# EAGLE design edu (EAGLE 7.7.0)

## Sheet 1 of 2
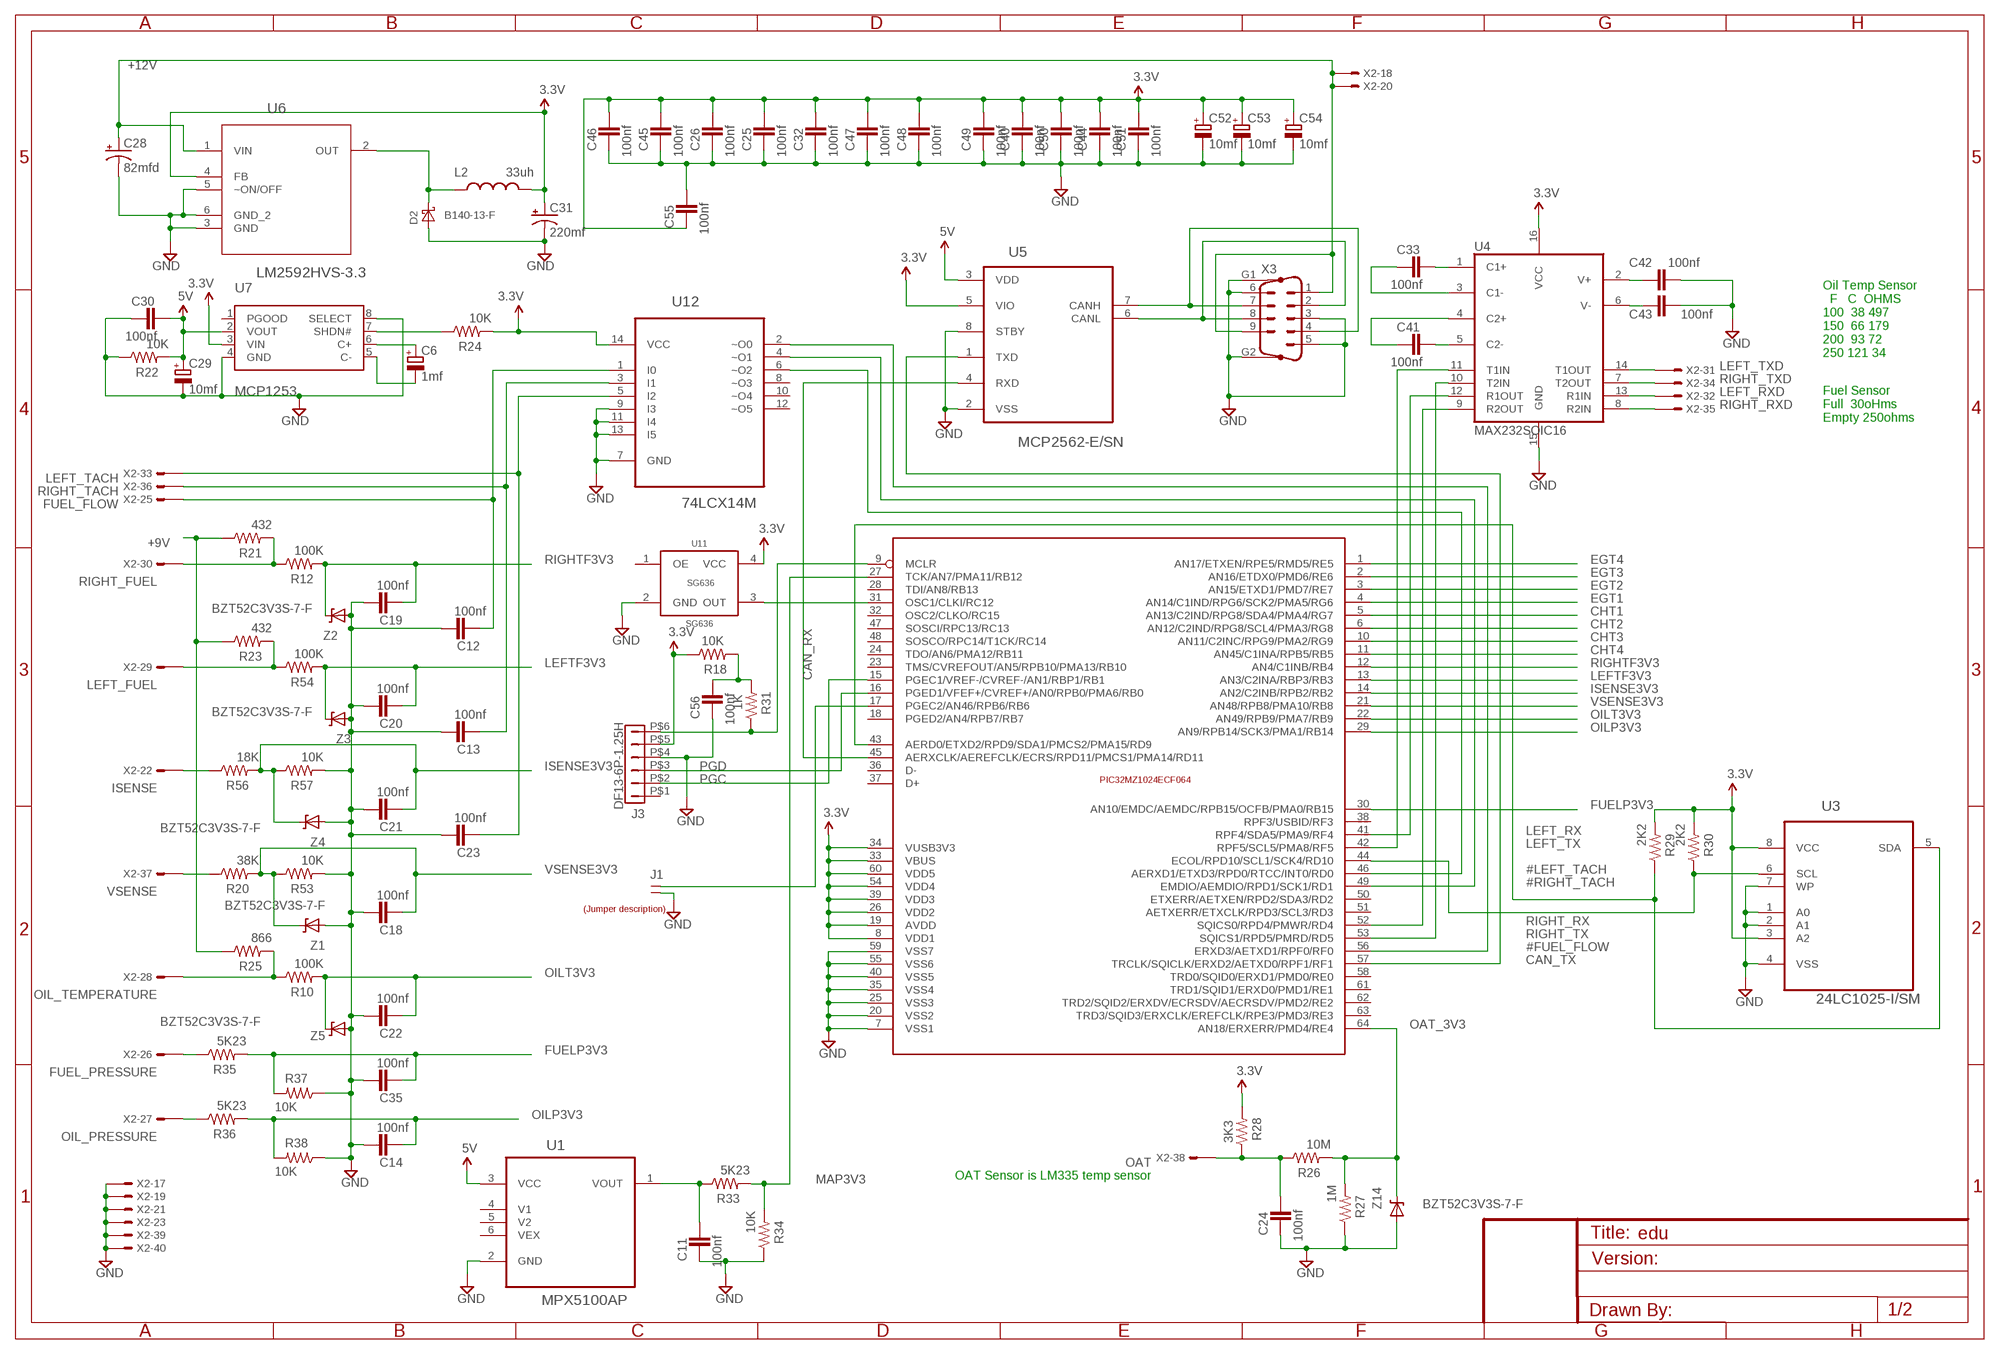
[diagram p0: schematic, sheet 1]

### Parts
C6  1mf  CAPACITOR_POL-SMC_A  [SMC_A]
C11  100nf  CAPACITOR_NPOL-0805  [C805]
C12  100nf  CAPACITOR_NPOL-0805  [C805]
C13  100nf  CAPACITOR_NPOL-0805  [C805]
C14  100nf  CAPACITOR_NPOL-0805  [C805]
C18  100nf  CAPACITOR_NPOL-0805  [C805]
C19  100nf  CAPACITOR_NPOL-0805  [C805]
C20  100nf  CAPACITOR_NPOL-0805  [C805]
C21  100nf  CAPACITOR_NPOL-0805  [C805]
C22  100nf  CAPACITOR_NPOL-0805  [C805]
C23  100nf  CAPACITOR_NPOL-0805  [C805]
C24  100nf  CAPACITOR_NPOL-0805  [C805]
C25  100nf  CAPACITOR_NPOL-0805  [C805]
C26  100nf  CAPACITOR_NPOL-0805  [C805]
C28  82mfd  CAPACITOR_POL-SVPF-E7  [SVPF-E7]
C29  10mf  CAPACITOR_POL-SMC_A  [SMC_A]
C30  100nf  CAPACITOR_NPOL-0805  [C805]
C31  220mf  CAP_POL7343  [EIA7343]
C32  100nf  CAPACITOR_NPOL-0805  [C805]
C33  100nf  CAPACITOR_NPOL-0805  [C805]
C35  100nf  CAPACITOR_NPOL-0805  [C805]
C40  100nf  CAPACITOR_NPOL-0805  [C805]
C41  100nf  CAPACITOR_NPOL-0805  [C805]
C42  100nf  CAPACITOR_NPOL-0805  [C805]
C43  100nf  CAPACITOR_NPOL-0805  [C805]
C44  100nf  CAPACITOR_NPOL-0805  [C805]
C45  100nf  CAPACITOR_NPOL-0805  [C805]
C46  100nf  CAPACITOR_NPOL-0805  [C805]
C47  100nf  CAPACITOR_NPOL-0805  [C805]
C48  100nf  CAPACITOR_NPOL-0805  [C805]
C49  100nf  CAPACITOR_NPOL-0805  [C805]
C50  100nf  CAPACITOR_NPOL-0805  [C805]
C51  100nf  CAPACITOR_NPOL-0805  [C805]
C52  10mf  CAPACITOR_POL-SMC_A  [SMC_A]
C53  10mf  CAPACITOR_POL-SMC_A  [SMC_A]
C54  10mf  CAPACITOR_POL-SMC_A  [SMC_A]
C55  100nf  CAPACITOR_NPOL-0805  [C805]
C56  100nf  CAPACITOR_NPOL-0805  [C805]
D2  B140-13-F  DIODE-SCHOTTKY-SMA  [SMA]
J1  M20-9770246  JUMPER-1X2  [JUMPER-1X2]
J3  DF13-6P-1.25H  [DF13A-6P-1.25H]
L2  33uh  INDUCTOR  [1812]
R10  100K  RESISTOR0603-RES  [0603-RES]
R12  100K  RESISTOR0603-RES  [0603-RES]
R18  10K  RESISTOR0603-RES  [0603-RES]
R20  38K  RESISTOR0603-RES  [0603-RES]
R21  432  RESISTOR0603-RES  [0603-RES]
R22  10K  RESISTOR0603-RES  [0603-RES]
R23  432  RESISTOR0603-RES  [0603-RES]
R24  10K  RESISTOR0603-RES  [0603-RES]
R25  866  RESISTOR0603-RES  [0603-RES]
R26  10M  RESISTOR0603-RES  [0603-RES]
R27  1M  RESISTOR0603-RES  [0603-RES]
R28  3K3  RESISTOR0603-RES  [0603-RES]
R29  2K2  RESISTOR0603-RES  [0603-RES]
R30  2K2  RESISTOR0603-RES  [0603-RES]
R31  1K  RESISTOR0603-RES  [0603-RES]
R33  5K23  RESISTOR0603-RES  [0603-RES]
R34  10K  RESISTOR0603-RES  [0603-RES]
R35  5K23  RESISTOR0603-RES  [0603-RES]
R36  5K23  RESISTOR0603-RES  [0603-RES]
R37  10K  RESISTOR0603-RES  [0603-RES]
R38  10K  RESISTOR0603-RES  [0603-RES]
R53  10K  RESISTOR0603-RES  [0603-RES]
R54  100K  RESISTOR0603-RES  [0603-RES]
R56  18K  RESISTOR0603-RES  [0603-RES]
R57  10K  RESISTOR0603-RES  [0603-RES]
U1  MPX5100AP  [FREESCALE_CASE_867B-04]
U3  24LC1025-I/SM  [SOIC8-N_MC]
U4  MAX232SOIC16  [SO016]
U5  MCP2562-E/SN  [SOIC-8N]
U6  LM2592HVS-3.3  LM2592HVS-5.0  [TO170P1435X457-5N]
U7  MCP1253  [MSOP8]
U11  SG636  [SG636]
U12  74LCX14M  [SOIC127P600X175-14N]
U$2  PIC32MZ1024  [TQFP-64]
U$5  LABEL_JUMPER_1X2  [JUMP2_DESC]
X2  057-040-1  [057-040-1]
X3  M09HP  [M09HP]
Z1  BZT52C3V3S-7-F  DIODE-ZENER-BZT52  [SOD-323]
Z2  BZT52C3V3S-7-F  DIODE-ZENER-BZT52  [SOD-323]
Z3  BZT52C3V3S-7-F  DIODE-ZENER-BZT52  [SOD-323]
Z4  BZT52C3V3S-7-F  DIODE-ZENER-BZT52  [SOD-323]
Z5  BZT52C3V3S-7-F  DIODE-ZENER-BZT52  [SOD-323]
Z14  BZT52C3V3S-7-F  DIODE-ZENER-BZT52  [SOD-323]

### Nets
3.3V: C25.1 C26.1 C31.A(+) C32.1 C40.1 C44.1 C45.1 C46.1 C47.1 C48.1 C49.1 C50.1 C51.1 C52.+ C53.+ C54.+ C55.2 J3.P$5 L2.2 R18.1 R24.2 R28.2 R29.2 R30.2 U3.3(A2) U3.8(VCC) U4.16(VCC) U5.5(VIO) U6.4(FB) U7.3(VIN) U11.4(VCC) U12.14(VCC) U$2.8(VDD1) U$2.19(AVDD) U$2.26(VDD2) U$2.33(VBUS) U$2.34(VUSB3V3) U$2.39(VDD3) U$2.54(VDD4) U$2.60(VDD5)
5V: C29.+ C30.1 R22.2 U1.3(VCC) U5.3(VDD) U7.2(VOUT)
!MCLR: J3.P$6 R31.1 U$2.9(MCLR)
#FUEL_FLOW: U12.2(~O0) U$2.56(ERXD3/AETXD1/RPF0/RF0)
#LEFT_TACH: U12.6(~O2) U$2.46(AERXD1/ETXD3/RPD0/RTCC/INT0/RD0)
#RIGHT_TACH: U12.4(~O1) U$2.49(EMDIO/AEMDIO/RPD1/SCK1/RD1)
+9V [8v]: R21.1 R23.1 R25.1 ; also sheet 2
+12V: C28.P$2(+) U6.1(VIN) X2.18 X2.20 X3.1 X3.9 ; also sheet 2
CAN_RX: U5.4(RXD) U$2.45(AERXCLK/AEREFCLK/ECRS/RPD11/PMCS1/PMA14/RD11)
CAN_TX: U5.1(TXD) U$2.57(TRCLK/SQICLK/ERXD2/AETXD0/RPF1/RF1)
CANH: U5.7(CANH) X3.4 X3.7
CANL: U5.6(CANL) X3.2 X3.8
CHT1: U$2.5(AN13/C2IND/RPG8/SDA4/PMA4/RG7) ; also sheet 2
CHT2: U$2.6(AN12/C2IND/RPG8/SCL4/PMA3/RG8) ; also sheet 2
CHT3: U$2.10(AN11/C2INC/RPG9/PMA2/RG9) ; also sheet 2
CHT4: U$2.11(AN45/C1INA/RPB5/RB5) ; also sheet 2
EGT1: U$2.4(AN14/C1IND/RPG6/SCK2/PMA5/RG6) ; also sheet 2
EGT2: U$2.3(AN15/ETXD1/PMD7/RE7) ; also sheet 2
EGT3: U$2.2(AN16/ETDX0/PMD6/RE6) ; also sheet 2
EGT4: U$2.1(AN17/ETXEN/RPE5/RMD5/RE5) ; also sheet 2
FUEL_FLOW: C12.2 U12.1(I0) X2.25
FUEL_PRESSURE: R35.1 X2.26
FUELP3V3: C35.2 R35.2 R37.2 U$2.30(AN10/EMDC/AEMDC/RPB15/OCFB/PMA0/RB15)
GND: C11.2 C12.1 C13.1 C14.1 C18.1 C19.1 C20.1 C21.1 C22.1 C23.1 C24.2 C25.2 C26.2 C28.P$1(-) C29.- C30.2 C31.C(-) C32.2 C35.1 C40.2 C42.1 C43.1 C44.2 C45.2 C46.2 C47.2 C48.2 C49.2 C50.2 C51.2 C52.- C53.- C54.- C55.1 C56.2 D2.A J1.2 J3.P$4 R22.1 R27.1 R34.1 R37.1 R38.1 R53.2 R57.2 U1.2(GND) U3.1(A0) U3.2(A1) U3.4(VSS) U3.7(WP) U4.15(GND) U5.2(VSS) U5.8(STBY) U6.3(GND) U6.5(~ON/OFF) U6.6(GND_2) U7.4(GND) U7.8(SELECT) U11.2(GND) U12.7(GND) U12.9(I3) U12.11(I4) U12.13(I5) U$2.7(VSS1) U$2.20(VSS2) U$2.25(VSS3) U$2.35(VSS4) U$2.40(VSS5) U$2.55(VSS6) U$2.59(VSS7) X2.17 X2.19 X2.21 X2.23 X2.39 X2.40 X3.3 X3.5 X3.6 X3.G1 X3.G2 Z1.2(A) Z2.2(A) Z3.2(A) Z4.2(A) Z5.2(A) Z14.2(A) ; also sheet 2
ISENSE: R56.1 X2.22
ISENSE3V3: C21.2 R56.2 R57.1 U$2.14(AN2/C2INB/RPB2/RB2) Z4.1(C)
LEFT_FUEL: R23.2 R54.1 X2.29
LEFT_RX: U4.12(R1OUT) U$2.41(RPF4/SDA5/PMA9/RF4)
LEFT_RXD: U4.13(R1IN) X2.32
LEFT_TACH: C23.2 U12.5(I2) X2.33
LEFT_TX: U4.11(T1IN) U$2.42(RPF5/SCL5/PMA8/RF5)
LEFT_TXD: U4.14(T1OUT) X2.31
LEFTF3V3: C20.2 R54.2 U$2.13(AN3/C2INA/RBP3/RB3) Z3.1(C)
MAP3V3: R33.2 R34.2 U$2.27(TCK/AN7/PMA11/RB12)
N$1: C56.1 R18.2 R31.2
N$2: R24.1 U7.7(SHDN#)
N$5: C33.1 U4.1(C1+)
N$6: C33.2 U4.3(C1-)
N$7: C41.2 U4.4(C2+)
N$9: C41.1 U4.5(C2-)
N$10: C42.2 U4.2(V+)
N$11: C43.2 U4.6(V-)
N$12: D2.C L2.1 U6.2(OUT)
N$16: U11.3(OUT) U$2.31(OSC1/CLKI/RC12)
N$35: J1.1 U$2.17(PGEC2/AN46/RPB6/RB6)
N$37: C6.- U7.5(C-)
N$38: C6.+ U7.6(C+)
N$55: C11.1 R33.1 U1.1(VOUT)
OAT: C24.1 R26.1 R28.1 X2.38
OAT_3V3: R26.2 R27.2 U$2.64(AN18/ERXERR/PMD4/RE4) Z14.1(C)
OIL_PRESSURE: R36.1 X2.27
OIL_TEMPERATURE: R10.1 R25.2 X2.28
OILP3V3: C14.2 R36.2 R38.2 U$2.29(AN9/RPB14/SCK3/PMA1/RB14)
OILT3V3: C22.2 R10.2 U$2.22(AN49/RPB9/PMA7/RB9) Z5.1(C)
PGC: J3.P$2 U$2.15(PGEC1/VREF-/CVREF-/AN1/RBP1/RB1)
PGD: J3.P$3 U$2.16(PGED1/VFEF+/CVREF+/AN0/RPB0/PMA6/RB0)
RIGHT_FUEL: R12.1 R21.2 X2.30
RIGHT_RX: U4.9(R2OUT) U$2.52(SQICS0/RPD4/PMWR/RD4)
RIGHT_RXD: U4.8(R2IN) X2.35
RIGHT_TACH: C13.2 U12.3(I1) X2.36
RIGHT_TX: U4.10(T2IN) U$2.53(SQICS1/RPD5/PMRD/RD5)
RIGHT_TXD: U4.7(T2OUT) X2.34
RIGHTF3V3: C19.2 R12.2 U$2.12(AN4/C1INB/RB4) Z2.1(C)
SCL: R30.1 U3.6(SCL) U$2.44(ECOL/RPD10/SCL1/SCK4/RD10)
SDA: R29.1 U3.5(SDA) U$2.43(AERD0/ETXD2/RPD9/SDA1/PMCS2/PMA15/RD9)
VSENSE: R20.1 X2.37
VSENSE3V3: C18.2 R20.2 R53.1 U$2.21(AN48/RPB8/PMA10/RB8) Z1.1(C)
Unconnected: J3.P$1 U1.4(V1) U1.5(V2) U1.6(VEX) U7.1(PGOOD) U11.1(OE) U12.8(~O3) U12.10(~O4) U12.12(~O5) U$2.18(PGED2/AN4/RPB7/RB7) U$2.23(TMS/CVREFOUT/AN5/RPB10/PMA13/RB10) U$2.24(TDO/AN6/PMA12/RB11) U$2.28(TDI/AN8/RB13) U$2.32(OSC2/CLKO/RC15) U$2.36(D-) U$2.37(D+) U$2.38(RPF3/USBID/RF3) U$2.47(SOSCI/RPC13/RC13) U$2.48(SOSCO/RPC14/T1CK/RC14) U$2.50(ETXERR/AETXEN/RPD2/SDA3/RD2) U$2.51(AETXERR/ETXCLK/RPD3/SCL3/RD3) U$2.58(TRD0/SQID0/ERXD1/PMD0/RE0) U$2.61(TRD1/SQID1/ERXD0/PMD1/RE1) U$2.62(TRD2/SQID2/ERXDV/ECRSDV/AECRSDV/PMD2/RE2) U$2.63(TRD3/SQID3/ERXCLK/EREFCLK/RPE3/PMD3/RE3)

### Notes on the sheet
- Oil Temp Sensor
    F   C  OHMS
  100  38 497
  150  66 179
  200  93 72
  250 121 34
- Fuel Sensor
  Full  30oHms
  Empty 250ohms
- OAT Sensor is LM335 temp sensor

## Sheet 2 of 2
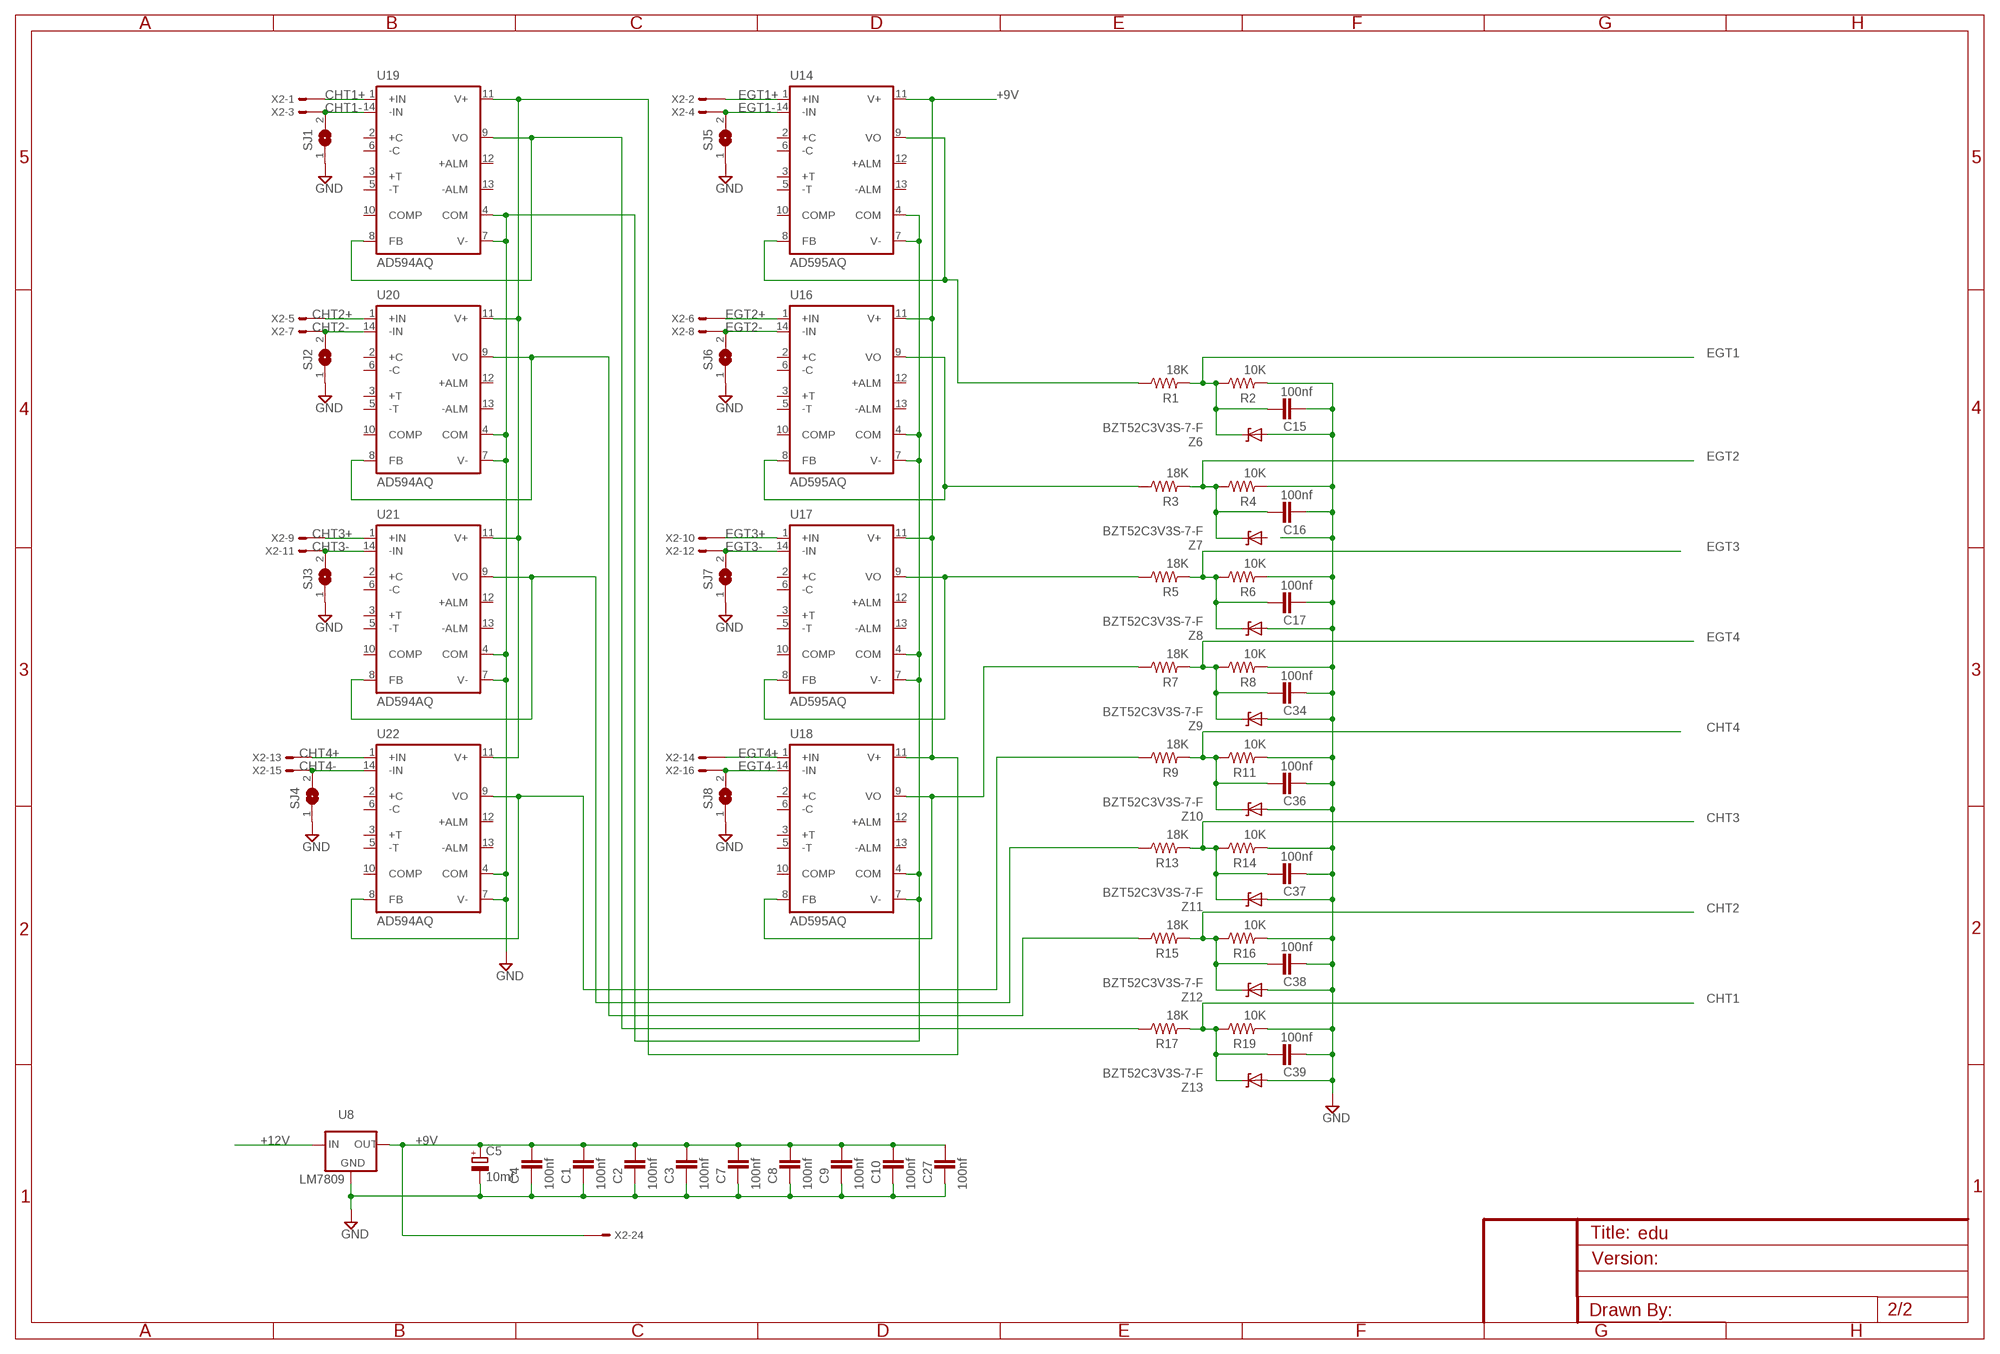
[diagram p1: schematic, sheet 2]

### Parts
C1  100nf  CAPACITOR_NPOL-0805  [C805]
C2  100nf  CAPACITOR_NPOL-0805  [C805]
C3  100nf  CAPACITOR_NPOL-0805  [C805]
C4  100nf  CAPACITOR_NPOL-0805  [C805]
C5  10mf  CAPACITOR_POL-SMC_A  [SMC_A]
C7  100nf  CAPACITOR_NPOL-0805  [C805]
C8  100nf  CAPACITOR_NPOL-0805  [C805]
C9  100nf  CAPACITOR_NPOL-0805  [C805]
C10  100nf  CAPACITOR_NPOL-0805  [C805]
C15  100nf  CAPACITOR_NPOL-0805  [C805]
C16  100nf  CAPACITOR_NPOL-0805  [C805]
C17  100nf  CAPACITOR_NPOL-0805  [C805]
C27  100nf  CAPACITOR_NPOL-0805  [C805]
C34  100nf  CAPACITOR_NPOL-0805  [C805]
C36  100nf  CAPACITOR_NPOL-0805  [C805]
C37  100nf  CAPACITOR_NPOL-0805  [C805]
C38  100nf  CAPACITOR_NPOL-0805  [C805]
C39  100nf  CAPACITOR_NPOL-0805  [C805]
R1  18K  RESISTOR0603-RES  [0603-RES]
R2  10K  RESISTOR0603-RES  [0603-RES]
R3  18K  RESISTOR0603-RES  [0603-RES]
R4  10K  RESISTOR0603-RES  [0603-RES]
R5  18K  RESISTOR0603-RES  [0603-RES]
R6  10K  RESISTOR0603-RES  [0603-RES]
R7  18K  RESISTOR0603-RES  [0603-RES]
R8  10K  RESISTOR0603-RES  [0603-RES]
R9  18K  RESISTOR0603-RES  [0603-RES]
R11  10K  RESISTOR0603-RES  [0603-RES]
R13  18K  RESISTOR0603-RES  [0603-RES]
R14  10K  RESISTOR0603-RES  [0603-RES]
R15  18K  RESISTOR0603-RES  [0603-RES]
R16  10K  RESISTOR0603-RES  [0603-RES]
R17  18K  RESISTOR0603-RES  [0603-RES]
R19  10K  RESISTOR0603-RES  [0603-RES]
SJ1  SOLDERJUMPERCLOSED  [SOLDERJUMPER_CLOSEDWIRE]
SJ2  SOLDERJUMPERCLOSED  [SOLDERJUMPER_CLOSEDWIRE]
SJ3  SOLDERJUMPERCLOSED  [SOLDERJUMPER_CLOSEDWIRE]
SJ4  SOLDERJUMPERCLOSED  [SOLDERJUMPER_CLOSEDWIRE]
SJ5  SOLDERJUMPERCLOSED  [SOLDERJUMPER_CLOSEDWIRE]
SJ6  SOLDERJUMPERCLOSED  [SOLDERJUMPER_CLOSEDWIRE]
SJ7  SOLDERJUMPERCLOSED  [SOLDERJUMPER_CLOSEDWIRE]
SJ8  SOLDERJUMPERCLOSED  [SOLDERJUMPER_CLOSEDWIRE]
U8  LM7809  78XXS  [78XXS]
U14  AD595AQ  AD594  [DIL14]
U16  AD595AQ  AD594  [DIL14]
U17  AD595AQ  AD594  [DIL14]
U18  AD595AQ  AD594  [DIL14]
U19  AD594AQ  AD594  [DIL14]
U20  AD594AQ  AD594  [DIL14]
U21  AD594AQ  AD594  [DIL14]
U22  AD594AQ  AD594  [DIL14]
Z6  BZT52C3V3S-7-F  DIODE-ZENER-BZT52  [SOD-323]
Z7  BZT52C3V3S-7-F  DIODE-ZENER-BZT52  [SOD-323]
Z8  BZT52C3V3S-7-F  DIODE-ZENER-BZT52  [SOD-323]
Z9  BZT52C3V3S-7-F  DIODE-ZENER-BZT52  [SOD-323]
Z10  BZT52C3V3S-7-F  DIODE-ZENER-BZT52  [SOD-323]
Z11  BZT52C3V3S-7-F  DIODE-ZENER-BZT52  [SOD-323]
Z12  BZT52C3V3S-7-F  DIODE-ZENER-BZT52  [SOD-323]
Z13  BZT52C3V3S-7-F  DIODE-ZENER-BZT52  [SOD-323]

### Nets
+9V [8v]: C1.1 C2.1 C3.1 C4.1 C5.+ C7.1 C8.1 C9.1 C10.1 C27.1 U8.OUT U14.11(V+) U16.11(V+) U17.11(V+) U18.11(V+) U19.11(V+) U20.11(V+) U21.11(V+) U22.11(V+) X2.24 ; also sheet 1
+12V: U8.IN ; also sheet 1
CHT1: C39.1 R17.2 R19.1 Z13.1(C) ; also sheet 1
CHT1+: U19.1(+IN) X2.1
CHT1-: SJ1.2 U19.14(-IN) X2.3
CHT2: C38.1 R15.2 R16.1 Z12.1(C) ; also sheet 1
CHT2+: U20.1(+IN) X2.5
CHT2-: SJ2.2 U20.14(-IN) X2.7
CHT3: C37.1 R13.2 R14.1 Z11.1(C) ; also sheet 1
CHT3+: U21.1(+IN) X2.9
CHT3-: SJ3.2 U21.14(-IN) X2.11
CHT4: C36.1 R9.2 R11.1 Z10.1(C) ; also sheet 1
CHT4+: U22.1(+IN) X2.13
CHT4-: SJ4.2 U22.14(-IN) X2.15
EGT1: C15.1 R1.2 R2.1 Z6.1(C) ; also sheet 1
EGT1+: U14.1(+IN) X2.2
EGT1-: SJ5.2 U14.14(-IN) X2.4
EGT2: C16.1 R3.2 R4.1 Z7.1(C) ; also sheet 1
EGT2+: U16.1(+IN) X2.6
EGT2-: SJ6.2 U16.14(-IN) X2.8
EGT3: C17.1 R5.2 R6.1 Z8.1(C) ; also sheet 1
EGT3+: U17.1(+IN) X2.10
EGT3-: SJ7.2 U17.14(-IN) X2.12
EGT4: C34.1 R7.2 R8.1 Z9.1(C) ; also sheet 1
EGT4+: U18.1(+IN) X2.14
EGT4-: SJ8.2 U18.14(-IN) X2.16
GND: C1.2 C2.2 C3.2 C4.2 C5.- C7.2 C8.2 C9.2 C10.2 C15.2 C16.2 C17.2 C27.2 C34.2 C36.2 C37.2 C38.2 C39.2 R2.2 R4.2 R6.2 R8.2 R11.2 R14.2 R16.2 R19.2 SJ1.1 SJ2.1 SJ3.1 SJ4.1 SJ5.1 SJ6.1 SJ7.1 SJ8.1 U8.GND U14.4(COM) U14.7(V-) U16.4(COM) U16.7(V-) U17.4(COM) U17.7(V-) U18.4(COM) U18.7(V-) U19.4(COM) U19.7(V-) U20.4(COM) U20.7(V-) U21.4(COM) U21.7(V-) U22.4(COM) U22.7(V-) Z6.2(A) Z8.2(A) Z9.2(A) Z10.2(A) Z11.2(A) Z12.2(A) Z13.2(A) ; also sheet 1
N$36: R7.1 U18.8(FB) U18.9(VO)
N$63: R1.1 U14.8(FB) U14.9(VO)
N$64: R3.1 U16.8(FB) U16.9(VO)
N$65: R5.1 U17.8(FB) U17.9(VO)
N$66: R17.1 U19.8(FB) U19.9(VO)
N$73: R9.1 U22.8(FB) U22.9(VO)
N$74: R13.1 U21.8(FB) U21.9(VO)
N$75: R15.1 U20.8(FB) U20.9(VO)
Unconnected: U14.2(+C) U14.3(+T) U14.5(-T) U14.6(-C) U14.10(COMP) U14.12(+ALM) U14.13(-ALM) U16.2(+C) U16.3(+T) U16.5(-T) U16.6(-C) U16.10(COMP) U16.12(+ALM) U16.13(-ALM) U17.2(+C) U17.3(+T) U17.5(-T) U17.6(-C) U17.10(COMP) U17.12(+ALM) U17.13(-ALM) U18.2(+C) U18.3(+T) U18.5(-T) U18.6(-C) U18.10(COMP) U18.12(+ALM) U18.13(-ALM) U19.2(+C) U19.3(+T) U19.5(-T) U19.6(-C) U19.10(COMP) U19.12(+ALM) U19.13(-ALM) U20.2(+C) U20.3(+T) U20.5(-T) U20.6(-C) U20.10(COMP) U20.12(+ALM) U20.13(-ALM) U21.2(+C) U21.3(+T) U21.5(-T) U21.6(-C) U21.10(COMP) U21.12(+ALM) U21.13(-ALM) U22.2(+C) U22.3(+T) U22.5(-T) U22.6(-C) U22.10(COMP) U22.12(+ALM) U22.13(-ALM) Z7.2(A)

## Library data of the parts
C1-C4 C7-C27 C30 C32-C51 C55 C56 = dp_devices:CAPACITOR_NPOL: Non-Polarized capacitor in various packages; PARTNO: CL21F104ZBCNNNC
C5 = dp_devices:CAPACITOR_POL: Polarized capacitor in various packages; PARTNO: CL31A106KAHNNNE
C6 = dp_devices:CAPACITOR_POL: Polarized capacitor in various packages; PARTNO: F931C105MAA
C28 = kotuku:CAPACITOR_POL: Polarized capacitor in various packages
C29 C52-C54 = dp_devices:CAPACITOR_POL: Polarized capacitor in various packages; PARTNO: T491A106K004AT
C31 = SparkFun:CAP_POL: Capacitor Polarized These are standard SMD and PTH capacitors. Normally 10uF, 47uF, and 100uF in electrolytic and tantalum varieties. Always verify the external diameter of the through hole cap, it varies with capacity, voltage, and manufacturer. The EIA devices should be standard.; PARTNO: T545X227M016ATE035
D2 = diode2:DIODE-SCHOTTKY-: SCHOTTKY DIODE; PARTNO: B140-13-F
J1 = QuantumOptics:JUMPER-1X2: Jumper, header, SIP on 0.1" grid, for option selection.; PARTNO: M20-9770246
J3 = con-hirose-df13:DF13-6P-1.25: DF13-6P 1.25mm Pitch Miniature Crimping Connector.; PARTNO: DF13A-6P-1.25H(20)
L2 = SparkFun:INDUCTOR: Inductors Basic Inductor/Choke - 0603 and 1206. Footprints are not proven and vary greatly between part numbers.; PARTNO: LQH43MN330K03L
R1 R3 R5 R7 R9 R13 R15 R17 R56 = SparkFun-Passives:RESISTOR: Resistor Basic schematic elements and footprints for 0603, 1206, and PTH resistors.; PARTNO: RC0603FR-0718KL
R2 R4 R6 R8 R11 R14 R16 R18 R19 R22 R24 R27 R28 R31 R34 R37 R38 R53 R57 = SparkFun-Passives:RESISTOR: Resistor Basic schematic elements and footprints for 0603, 1206, and PTH resistors.; PARTNO: RC0603FR-0710KL
R10 R12 R54 = SparkFun-Passives:RESISTOR: Resistor Basic schematic elements and footprints for 0603, 1206, and PTH resistors.; PARTNO: RC0603FR-07100KL
R20 = SparkFun-Passives:RESISTOR: Resistor Basic schematic elements and footprints for 0603, 1206, and PTH resistors.; PARTNO: RC0603FR-0738K3L
R21 R23 = SparkFun-Passives:RESISTOR: Resistor Basic schematic elements and footprints for 0603, 1206, and PTH resistors.; PARTNO: RC0603FR-07432RL
R25 = SparkFun-Passives:RESISTOR: Resistor Basic schematic elements and footprints for 0603, 1206, and PTH resistors.; PARTNO: RC0603FR-07866RL
R26 R33 R35 R36 = SparkFun-Passives:RESISTOR: Resistor Basic schematic elements and footprints for 0603, 1206, and PTH resistors.; PARTNO: RC0603FR-075K23L
R29 R30 = SparkFun-Passives:RESISTOR: Resistor Basic schematic elements and footprints for 0603, 1206, and PTH resistors.; PARTNO: RC0603FR-072K2L
SJ1-SJ8 = microbuilder:SOLDERJUMPER: SMD Solder JUMPER Solder the two pads together to create a connection, or remove the solder to break it. REFLOW - Use this footprint for solder paste and reflow ovens. WAVE - Use this footprint for hand-soldering (larger pads). CLOSED - Has a trace between the two pads to ensure it is closed by default. The trace needs to be cut to disable the jumper, and can be closed again by creating a solder bridge between the two pads.
U1 = MPX5100AP:MPX5100AP: IC, PRESSURE SENSOR, 0 TO 100KPA, SIP-6; MPN: MPX5100AP; OC_FARNELL: 1457156; OC_NEWARK: 07F9928; PACKAGE: CASE 867B-04; SUPPLIER: FREESCALE SEMICONDUCTOR
U3 = Microchip_By_element14_Batch_1:24LC1025-I/SM: 1024K I2C CMOS Serial EEPROM; PARTNO: 24LC1025-I/P
U4 = SparkFun:MAX232: RS232 Transceiver Very common IC. This is generically called 'MAX232', but works with the 3V equivalent MAX3232 generic ICs. Field tested and mother approved. Spark Fun Electronics SKU : COM-00316 (DIP) and COM-00589 (SMD); PARTNO: MAX3232ECDR
U5 = Microchip-MCP2562-E_SN:MCP2562-E/SN: High-Speed CAN Transceiver,SOIC-8; PARTNO: MCP2562-E/SN
U6 = NSC_By_element14_Batch_1.1:LM2592HVS-5.0: SIMPLE SWITCHER; MPN: LM2592HVS-5.0; OC_FARNELL: -; OC_NEWARK: 41K3791; PACKAGE: TO-263-5; PARTNO: LM2592HVSX-3.3/NOPB; SUPPLIER: National Semiconductor
U7 = microchip-dspic:MCP1253: Positive-Regulated Charge Pump (3.3x5.0); PARTNO: MCP1253-33X50I/MS
U8 = v-reg:78XXS: VOLTAGE REGULATOR; PARTNO: LM7808CT
U11 = epson:SG636; PARTNO: SG-636PCE 10.000MHZ
U12 = Fairchild_By_element14_Batch_1:74LCX14M: Low Voltage Hex Inverter; MPN: 74LCX14M; OC_FARNELL: 1013778; OC_NEWARK: 78K6290; PACKAGE: SOIC-14; PARTNO: 74LCX14MX; SUPPLIER: Fairchild
U14 U16-U22 = analog-devices:AD594: ANALOG DEVICES; MF: ALTERA CORPORATION; MPN: AD594AQ; OC_FARNELL: 409182; OC_NEWARK: 05F7088
U$2 = PIC32MZ1024ECF064:PIC32MZ1024
U$5 = dp_devices:LABEL_JUMPER_1X2: Nice formatted two legged jumperdescription Use attributes to change the values ON = With jumper OFF = Without jumper; OFF: Normal; ON: Reset
X2 = con-panduit-changed:057-040-: CONNECTOR 40-pin series 057 contact pc board low profile headers; MF: SBH11-PBPC-D20-ST-BK; OC_FARNELL: unknown; OC_NEWARK: unknown; PARTNO: SBH11-PBPC-D20-ST-BK
X3 = con-subd:M09HP: SUB-D; OC_FARNELL: unknown; OC_NEWARK: unknown
Z1-Z14 = SparkFun:DIODE-ZENER: Zener Diode Production Part - 8199 3.4V Zener Voltage; PARTNO: BZT52C3V3S-7-F

## Net classes
0 default: width 0.152 mm, drill 0.305 mm, clearance 0.152 mm
1 8v: width 0.152 mm, drill 0.305 mm, clearance 0.152 mm
2 12v: width 0.152 mm, drill 0.305 mm, clearance 0.305 mm

## Board
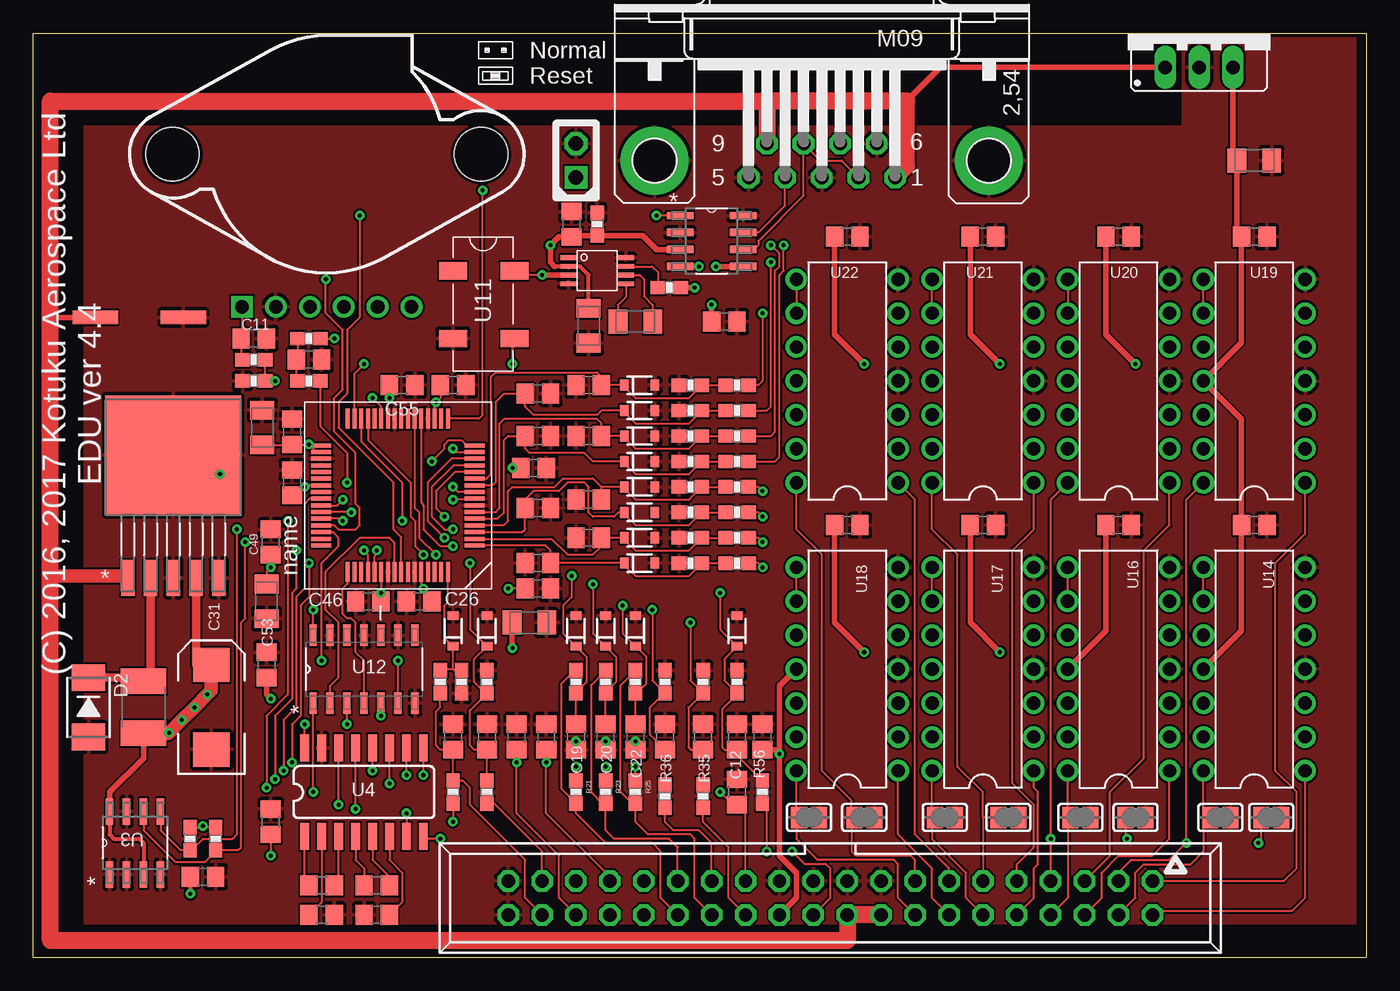
[diagram p2: board, top side]
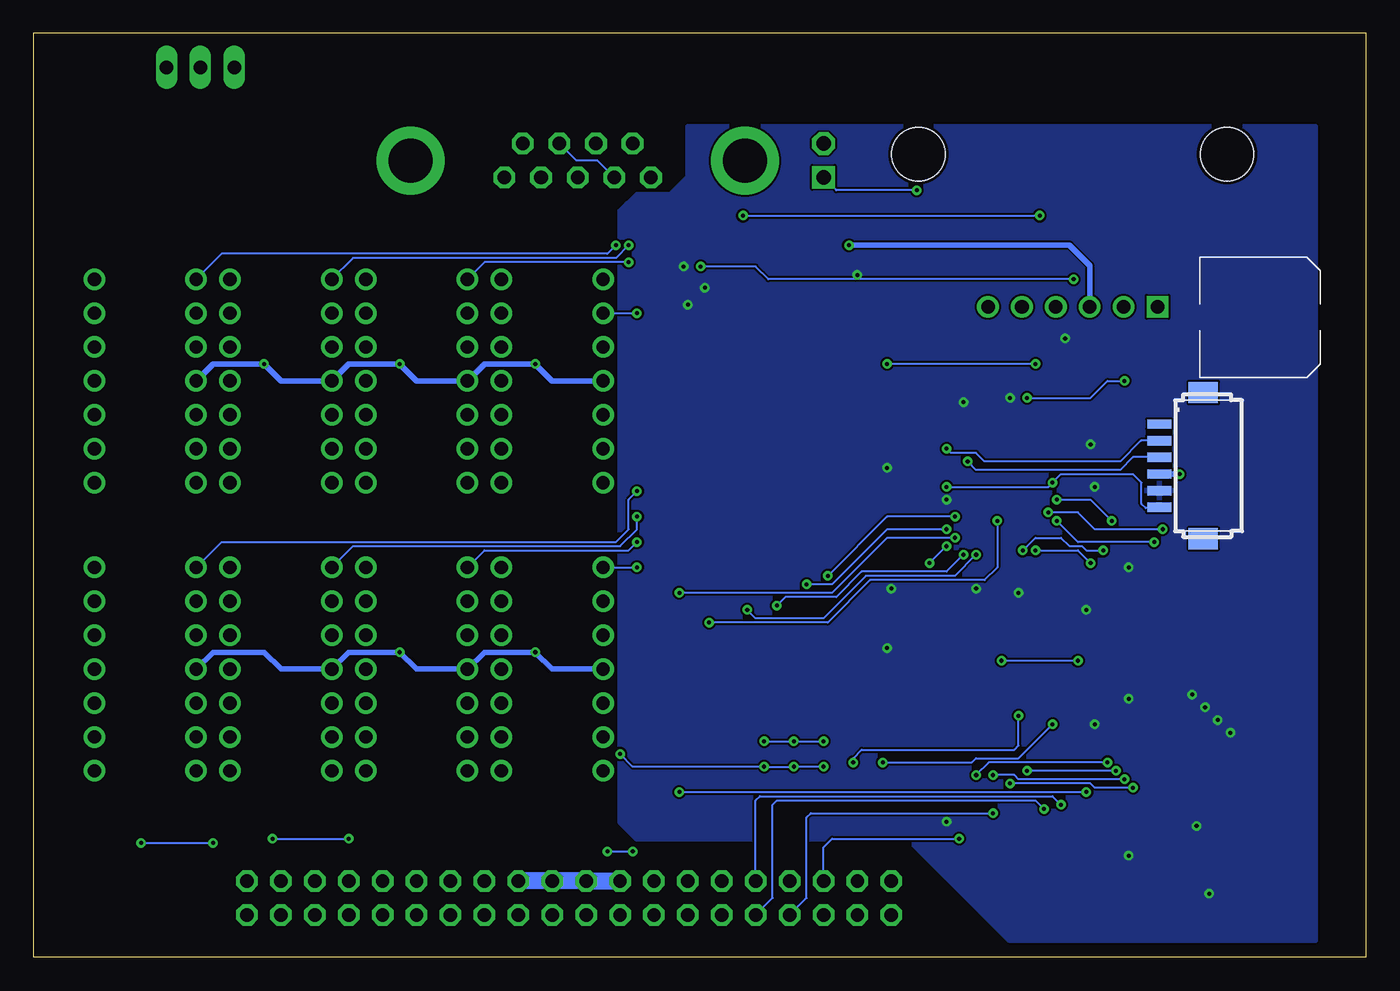
[diagram p3: board, bottom side, seen from below]

Size 99.82 x 69.22 mm. Coordinates in mm from the lower left corner, seen from the top.
Outline: 0,0 0,69.22 99.82,69.22 99.82,0 0,0
Copper layers (1*16): Top 0.035mm / dielectric 1.5mm / Bottom 0.035mm
Design rules "DFRobot_Eagle_Rule_v0.4": minimum track width 6mil, minimum drill 12mil, track to track 6mil, track to pad 6mil, pad to pad 6mil, via to via 6mil, smd to smd 0mil, copper to edge 10mil, drill to drill 10mil, minimum pad ring 12mil, minimum via ring 8mil, stop-mask expansion 2mil, vias tented up to drill 25mil, thermal gap 10mil

### Footprints (pad centres in the part's own frame; a part is rotated, then mirrored left to right if it is on the bottom)
C805 = smd 1.3 x 1.5: 1 -0.95,0; 2 0.95,0
SMC_A = smd 1.4 x 1.8: + -1.3,0; - 1.3,0
SVPF-E7 = smd 1 x 3.4: P$1 0,3.3; P$2 0,-3.3
EIA7343 = smd 2.55 x 2.7: A 3.17,0; C -3.17,0
SMA = smd 2 x 2.5: A 2.223,0; C -2.223,0
JUMPER-1X2 = drill 1.092 square: 1 0,2.54 | drill 1.092 octagon: 2 0,0
DF13A-6P-1.25H = smd 1.6 x 2.2: M$0 -5.475,2.4; M$1 5.475,2.4 | smd 0.7 x 1.8: P$1 -3.125,-0.9; P$2 -1.875,-0.9; P$3 -0.625,-0.9; P$4 0.625,-0.9; P$5 1.875,-0.9; P$6 3.125,-0.9
1812 = smd 1.9 x 3.4: 1 -1.95,0; 2 1.95,0
0603-RES = smd 1.1 x 1: 1 -0.85,0; 2 0.85,0
SOLDERJUMPER_CLOSEDWIRE = smd 1.168 x 1.6: 1 -0.762,0; 2 0.762,0 | smd 0.635 x 0.203: WIRE 0,0
FREESCALE_CASE_867B-04 = drill 1.016 square: 1 -12.7,2.54 | drill 1.016: 2 -10.16,2.54; 3 -7.62,2.54; 4 -5.08,2.54; 5 -2.54,2.54; 6 0,2.54 | hole 4: 5.205,13.97; -17.905,13.97
SOIC8-N_MC = smd 1.981 x 0.559: 1 -2.362,1.905; 2 -2.362,0.635; 3 -2.362,-0.635; 4 -2.362,-1.905; 5 2.362,-1.905; 6 2.362,-0.635; 7 2.362,0.635; 8 2.362,1.905
SO016 = smd 0.66 x 2.032: 1 -4.445,-3.315; 2 -3.175,-3.315; 3 -1.905,-3.315; 4 -0.635,-3.315; 5 0.635,-3.315; 6 1.905,-3.315; 7 3.175,-3.315; 8 4.445,-3.315; 9 4.445,3.315; 10 3.175,3.315; 11 1.905,3.315; 12 0.635,3.315; 13 -0.635,3.315; 14 -1.905,3.315; 15 -3.175,3.315; 16 -4.445,3.315
SOIC-8N = smd 1.981 x 0.559: 1 1.448,5.715; 2 1.448,4.445; 3 1.448,3.175; 4 1.448,1.905; 5 6.172,1.905; 6 6.172,3.175; 7 6.172,4.445; 8 6.172,5.715
TO170P1435X457-5N = smd 1.016 x 2.692: 1 -3.404,-9.042; 2 -1.702,-9.042; 3 0,-9.042; 4 1.702,-9.042; 5 3.404,-9.042 | smd 10.16 x 8.941: 6 0,0.152
MSOP8 = smd 1.2 x 0.35: 1 -2.145,0.975; 2 -2.145,0.325; 3 -2.145,-0.325; 4 -2.145,-0.975; 5 2.145,-0.975; 6 2.145,-0.325; 7 2.145,0.325; 8 2.145,0.975
78XXS = drill 1.016 long: GND 0,-2.54; IN -2.54,-2.54; OUT 2.54,-2.54
SG636 = smd 1.3 x 2.1: 1 0,0; 2 5.08,0; 3 5.08,4.6; 4 0,4.6
SOIC127P600X175-14N = smd 1.6 x 0.559: 1 -2.54,3.81; 2 -2.54,2.54; 3 -2.54,1.27; 4 -2.54,0; 5 -2.54,-1.27; 6 -2.54,-2.54; 7 -2.54,-3.81; 8 2.54,-3.81; 9 2.54,-2.54; 10 2.54,-1.27; 11 2.54,0; 12 2.54,1.27; 13 2.54,2.54; 14 2.54,3.81
DIL14 = drill 1: 1 -7.62,-3.81; 2 -5.08,-3.81; 3 -2.54,-3.81; 4 0,-3.81; 5 2.54,-3.81; 6 5.08,-3.81; 7 7.62,-3.81; 8 7.62,3.81; 9 5.08,3.81; 10 2.54,3.81; 11 0,3.81; 12 -2.54,3.81; 13 -5.08,3.81; 14 -7.62,3.81
TQFP-64 = smd 0.3 x 1.5: 1 -3.75,-5.75; 2 -3.25,-5.75; 3 -2.75,-5.75; 4 -2.25,-5.75; 5 -1.75,-5.75; 6 -1.25,-5.75; 7 -0.75,-5.75; 8 -0.25,-5.75; 9 0.25,-5.75; 10 0.75,-5.75; 11 1.25,-5.75; 12 1.75,-5.75; 13 2.25,-5.75; 14 2.75,-5.75; 15 3.25,-5.75; 16 3.75,-5.75; 33 3.75,5.75; 34 3.25,5.75; 35 2.75,5.75; 36 2.25,5.75; 37 1.75,5.75; 38 1.25,5.75; 39 0.75,5.75; 40 0.25,5.75; 41 -0.25,5.75; 42 -0.75,5.75; 43 -1.25,5.75; 44 -1.75,5.75; 45 -2.25,5.75; 46 -2.75,5.75; 47 -3.25,5.75; 48 -3.75,5.75 | smd 1.5 x 0.3: 17 5.75,-3.75; 18 5.75,-3.25; 19 5.75,-2.75; 20 5.75,-2.25; 21 5.75,-1.75; 22 5.75,-1.25; 23 5.75,-0.75; 24 5.75,-0.25; 25 5.75,0.25; 26 5.75,0.75; 27 5.75,1.25; 28 5.75,1.75; 29 5.75,2.25; 30 5.75,2.75; 31 5.75,3.25; 32 5.75,3.75; 49 -5.75,3.75; 50 -5.75,3.25; 51 -5.75,2.75; 52 -5.75,2.25; 53 -5.75,1.75; 54 -5.75,1.25; 55 -5.75,0.75; 56 -5.75,0.25; 57 -5.75,-0.25; 58 -5.75,-0.75; 59 -5.75,-1.25; 60 -5.75,-1.75; 61 -5.75,-2.25; 62 -5.75,-2.75; 63 -5.75,-3.25; 64 -5.75,-3.75
057-040-1 = drill 1 octagon: 1 -24.13,-1.27; 2 -24.13,1.27; 3 -21.59,-1.27; 4 -21.59,1.27; 5 -19.05,-1.27; 6 -19.05,1.27; 7 -16.51,-1.27; 8 -16.51,1.27; 9 -13.97,-1.27; 10 -13.97,1.27; 11 -11.43,-1.27; 12 -11.43,1.27; 13 -8.89,-1.27; 14 -8.89,1.27; 15 -6.35,-1.27; 16 -6.35,1.27; 17 -3.81,-1.27; 18 -3.81,1.27; 19 -1.27,-1.27; 20 -1.27,1.27; 21 1.27,-1.27; 22 1.27,1.27; 23 3.81,-1.27; 24 3.81,1.27; 25 6.35,-1.27; 26 6.35,1.27; 27 8.89,-1.27; 28 8.89,1.27; 29 11.43,-1.27; 30 11.43,1.27; 31 13.97,-1.27; 32 13.97,1.27; 33 16.51,-1.27; 34 16.51,1.27; 35 19.05,-1.27; 36 19.05,1.27; 37 21.59,-1.27; 38 21.59,1.27; 39 24.13,-1.27; 40 24.13,1.27
M09HP = drill 1.016 octagon: 1 -5.486,1.27; 2 -2.743,1.27; 3 0,1.27; 4 2.743,1.27; 5 5.486,1.27; 6 -4.115,-1.27; 7 -1.372,-1.27; 8 1.372,-1.27; 9 4.115,-1.27 | drill 3.302 pad 5.08: G1 -12.522,0; G2 12.522,0
SOD-323 = smd 0.63 x 0.83: 1 -1.15,0; 2 1.15,0

### Placement (x,y rotation side)
C1  91.44,53.98 0 top
C2  81.28,53.98 0 top
C3  71.12,53.98 0 top
C4  54.61,16.51 90 top
C5  91.44,59.69 0 top
C6  45.09,47.62 180 top
C7  60.96,53.98 0 top
C8  91.44,32.38 0 top
C9  81.28,32.38 0 top
C10  71.12,32.38 0 top
C11  16.51,46.35 0 top
C12  52.7,12.38 270 top
C13  36.2,16.51 270 top
C14  47.31,16.51 270 top
C15  41.59,34.29 180 top
C16  37.78,33.66 0 top
C17  41.59,31.43 180 top
C18  33.97,16.51 270 top
C19  40.64,16.51 90 top
C20  42.86,16.51 90 top
C21  52.7,16.51 270 top
C22  45.09,16.51 90 top
C23  38.42,16.51 270 top
C24  31.43,16.51 90 top
C25  19.37,35.56 90 top
C26  28.89,26.67 180 top
C27  60.96,32.38 0 top
C28  7.94,47.94 270 top
C29  41.59,47.31 270 top
C30  40.32,54.93 90 top
C31  13.34,18.73 90 top
C32  19.37,39.37 90 top
C33  21.59,5.4 0 top
C34  37.78,29.53 180 top
C35  50.16,16.51 270 top
C36  41.59,42.86 180 top
C37  37.78,42.23 0 top
C38  41.59,39.05 180 top
C39  37.78,39.05 0 top
C40  31.43,42.86 0 top
C41  25.72,5.4 180 top
C42  21.59,3.17 180 top
C43  25.72,3.17 0 top
C44  37.78,27.62 0 top
C45  37.47,36.67 0 top
C46  25.08,26.67 180 top
C47  51.75,47.62 0 top
C48  17.78,10.16 90 top
C49  17.78,31.11 90 top
C50  12.7,6.03 0 top
C51  17.46,21.91 90 top
C52  17.14,39.69 90 top
C53  17.46,26.67 270 top
C54  37.15,25.08 0 top
C55  27.62,42.86 180 top
C56  20.64,44.77 0 top
D2  4.13,18.73 270 top
J1  40.64,60.96 180 top
J3  14.61,36.83 270 bottom
L2  8.26,18.73 270 top
R1  52.7,35.24 180 top
R2  49.21,35.24 180 top
R3  52.7,33.34 180 top
R4  49.21,33.34 180 top
R5  52.7,31.43 180 top
R6  49.21,31.43 180 top
R7  52.7,29.53 180 top
R8  49.21,29.53 180 top
R9  52.7,42.86 180 top
R10  45.09,20.64 270 top
R11  49.21,42.86 180 top
R12  40.64,20.64 270 top
R13  52.7,40.96 180 top
R14  49.21,40.96 180 top
R15  52.7,39.05 180 top
R16  49.21,39.05 180 top
R17  52.7,37.15 180 top
R18  20.64,46.35 180 top
R19  49.21,37.15 180 top
R20  33.97,12.38 90 top
R21  40.64,12.38 270 top
R22  42.23,54.93 270 top
R23  42.86,12.38 270 top
R24  47.62,50.16 0 top
R25  45.09,12.38 270 top
R26  30.48,20.64 90 top
R27  32.07,20.64 90 top
R28  31.43,12.38 270 top
R29  11.75,8.89 90 top
R30  13.65,8.89 90 top
R31  20.64,43.18 180 top
R33  16.51,44.77 0 top
R34  16.51,43.18 0 top
R35  50.16,12.06 90 top
R36  47.31,12.06 90 top
R37  50.16,20.64 270 top
R38  47.31,20.64 270 top
R53  33.97,20.64 90 top
R54  42.86,20.64 270 top
R56  54.61,12.38 90 top
R57  52.7,20.64 90 top
SJ1  92.71,10.48 180 top
SJ2  82.55,10.48 180 top
SJ3  73.03,10.48 180 top
SJ4  62.23,10.48 180 top
SJ5  88.9,10.48 180 top
SJ6  78.42,10.48 180 top
SJ7  68.26,10.48 180 top
SJ8  58.1,10.48 180 top
U1  28.32,46.19 0 top
U3  7.62,8.57 90 top
U4  24.77,12.38 0 top
U5  46.99,49.85 0 top
U6  10.48,37.47 0 top
U7  42.23,51.44 0 top
U8  87.31,69.22 0 top
U11  31.43,51.44 270 top
U12  24.77,21.59 90 top
U14  91.44,21.59 90 top
U16  81.28,21.59 90 top
U17  71.12,21.59 90 top
U18  60.96,21.59 90 top
U19  91.44,43.18 90 top
U20  81.28,43.18 90 top
U21  71.12,43.18 90 top
U22  60.96,43.18 90 top
U$2  27.3,34.61 90 top
U$5  37.15,66.67 0 top
X2  59.69,4.45 180 top
X3  59.05,59.69 180 top
Z1  33.97,24.45 90 top
Z2  40.64,24.45 90 top
Z3  42.86,24.45 90 top
Z4  52.7,24.45 90 top
Z5  45.09,24.45 90 top
Z6  45.4,35.24 0 top
Z7  45.4,33.34 0 top
Z8  45.4,31.43 0 top
Z9  45.4,29.53 0 top
Z10  45.4,42.86 0 top
Z11  45.4,40.96 0 top
Z12  45.4,39.05 0 top
Z13  45.4,37.15 0 top
Z14  31.43,24.45 90 top

### Tracks (layer width: path | path; a pad name or v marks a point on that pad's centre or on a via)
3.3V  (via drill 0.3)
  Top 0.152: U4.16 v20.32,17.46 | R30.2 12.6,9.74 v12.7,9.84 12.8,9.74 R29.2 | C48.1 v17.78,7.62 | U12.14 v20.95,26.04 | R28.2 v31.43,10.16 | U$2.8 33.05,34.29 v31.43,34.29 | C44.1 v35.56,27.62 | C49.1 v17.78,29.21 17.46,28.89 C53.+ | v38.11,51.11 36.36,51.11 U11.4 | C46.1 v26.04,27.3 26.04,28.84 U$2.54 | U$2.60 29.05,27.78 v29.21,27.62 29.84,26.99 C26.1 | C45.1 v35.88,36.67 | U$2.26 26.55,41.8 v26.67,41.91 26.67,41.59 C55.2 | U$2.19 30.05,41.48 v30.16,41.59 30.48,41.91 C40.1 | U$2.33 20.7,38.36 v20.64,38.42 | U$2.34 21.2,37.86 v20.64,38.42 | v20.64,38.42 C32.1 19.34,38.39 C52.+ | U$2.39 20.43,35.36 v20.32,35.24 19.69,34.61 C25.1 | R18.1 v22.54,46.35
  Top 0.305: U3.8 5.71,9.21 6.03,8.89 7.94,8.89 8.26,8.57 U3.3 | C50.1 v11.75,4.76
  Top 0.406: U7.3 v38.11,51.11 v38.1,51.12 | U5.5 v51.12,51.75 | R24.2 v49.53,50.16 | C47.1 v50.8,48.89 v50.8,48.9 | U3.8 5.71,12.38 8.26,14.92 L2.2 | C54.+ 35.85,23.21 v35.88,23.18 | C51.1 17.46,19.68 v17.78,19.37
  Top 0.635: U6.4 12.18,21.9 C31.A
  Top 1.016: L2.2 10.12,16.78 v10.16,16.83 v11.11,17.78 v12.06,18.73 v13.02,19.68 13.34,20 C31.A
  pour Bottom: 3.81,62.23 50.8,62.23 50.8,58.42 52.07,57.15 54.61,57.15 55.88,55.88 55.88,10.16 54.61,8.89 34.29,8.89 26.67,1.27 3.81,1.27
5V  (via drill 0.3)
  Top 0.305: U7.2 39.05,51.75 | C29.+ 41.59,51.12 40.95,51.76 U7.2
  Top 0.406: U7.2 | 39.05,51.75 38.73,52.07 v38.73,53.34 39.37,53.98 C30.1 40.42,54.08 R22.2 45.62,54.08 46.67,53.02 U5.3
  Bottom 0.406: U1.3 20.7,51.82 22.23,53.34 v38.73,53.34
!MCLR  (via drill 0.3)
  Top 0.152: U$2.9 31.82,34.86 v31.43,35.24 | R31.1 21.49,39.79 23.5,37.78 v23.5,35.56
  Bottom 0.152: J3.P$6 15.55,33.66 16.51,33.66 16.83,33.97 16.83,35.56 17.46,36.2 22.86,36.2 v23.5,35.56 23.81,35.24 v31.43,35.24
#FUEL_FLOW
  Top 0.152: U12.2 22.23,20.32 22.86,20.95 22.86,25.08 21.91,26.04 21.91,28.89 24.45,31.43 26.67,31.43 27.05,31.05 U$2.56
#LEFT_TACH  (via drill 0.3)
  Top 0.152: U12.6 v27.3,22.23 | v21.59,22.23 21.59,29.53 22.86,30.8 22.86,31.43 22.43,31.86 U$2.46
  Bottom 0.152: v27.3,22.23 v21.59,22.23
#RIGHT_TACH
  Top 0.152: U12.4 24.77,22.23 24.13,22.86 24.13,25.08 23.81,25.4 23.5,25.4 23.18,25.72 23.18,27.62 23.55,28 U$2.49
+9V  (via drill 0.3)
  Top 0.152: R21.1 v40.64,14.29 | v42.86,14.29 R23.1 | R25.1 v45.09,14.29
  Top 0.305: 90.14,54.33 C1.1 | 89.85,59.98 C5.+
  Top 0.406: X2.24 57.15,4.45 57.15,6.35 55.88,7.62 v55.88,15.24 55.88,15.56 | 55.88,15.56 55.88,20.32 U18.11 | U14.11 90.49,24.45 C8.1 90.49,40.32 U19.11 90.49,46.04 C1.1 | C9.1 80.33,24.45 U16.11 | C10.1 70.17,25.08 v72.39,22.86 | C27.1 60.01,25.08 v62.23,22.86 | C2.1 80.33,46.67 v82.55,44.45 | C3.1 70.17,46.67 v72.39,44.45 | C7.1 60.01,46.67 v62.23,44.45 | C4.1 55.88,15.56 | C5.+ 90.14,54.33 | U8.OUT 89.85,59.98
  Bottom 0.152: v40.64,14.29 v42.86,14.29 v45.09,14.29 54.93,14.29 v55.88,15.24
  Bottom 0.406: U18.11 60.96,21.59 v62.23,22.86 66.04,22.86 U17.11 71.12,21.59 v72.39,22.86 76.2,22.86 U16.11 81.28,21.59 82.55,22.86 86.36,22.86 U14.11 | U22.11 60.96,43.18 v62.23,44.45 66.04,44.45 U21.11 71.12,43.18 v72.39,44.45 76.2,44.45 U20.11 81.28,43.18 v82.55,44.45 86.36,44.45 U19.11
+12V
  Top 0.406: 65.41,64.14 67.94,66.67 U8.IN | C28.P$2 1.27,47.94 1.27,51.12
  Top 1.016: U6.1 6.92,28.57 1.27,28.57
  Top 1.27: 1.27,53.98 1.27,51.12 1.27,28.57 1.27,1.27 60.96,1.27 X2.20 X2.18 | 1.27,53.98 1.27,64.14 54.94,64.14 | 1.27,53.97 1.27,53.98 | 54.94,64.14 X3.9 | X3.1 65.41,59.28 65.41,64.14 54.94,64.14
CAN_RX  (via drill 0.3)
  Top 0.152: v21.91,50.8 21.91,48.26 23.18,46.99 23.18,42.55 22.54,41.91 22.54,39.37 24.13,37.78 24.13,33.97 24.45,33.66 24.45,32.38 24.13,32.07 22.86,32.07 22.54,32.38 21.58,32.38 U$2.45 | v49.85,51.75 U5.4
  Bottom 0.152: v21.91,50.8 44.77,50.8 45.72,51.75 v49.85,51.75
CAN_TX  (via drill 0.3)
  Top 0.152: U5.1 v46.67,55.56 | v24.45,55.56 24.45,47.94 23.5,46.99 23.5,42.23 22.86,41.59 22.86,39.69 26.99,35.56 26.99,32.07 27.55,31.5 U$2.57
  Bottom 0.152: v46.67,55.56 v24.45,55.56
CANH
  Top 0.152: U5.7 54.29,54.29 56.31,56.31 X3.4
  Bottom 0.152: X3.4 57.58,59.69 59.16,59.69 X3.7
CANL
  Top 0.152: U5.6 53.98,53.02 54.29,53.34 54.29,53.66 57.68,57.05 X3.8 58.95,59.69 60.53,59.69 X3.2
CHT1
  Top 0.152: R17.2 R19.1 49.11,36.2 45.09,36.2 44.25,37.03 Z13.1 41.91,37.15 41.27,37.78 37.15,37.78 36.83,38.1 C39.1 35.56,39.05 35.24,38.73 35.24,33.34 34.76,32.86 U$2.5
CHT1+
  Top 0.152: X2.1 93.66,5.71 94.61,6.67 94.61,12.38 93.03,13.97 93.03,29.53 95.25,31.75 U19.1
CHT1-  (via drill 0.3)
  Top 0.152: X2.3 81.28,6.35 82.23,7.3 85.09,7.3 v86.36,8.57 86.36,34.29 U19.14 | SJ1.2 91.95,8.76 v91.76,8.57
  Bottom 0.152: v91.76,8.57 v86.36,8.57
CHT2
  Top 0.152: R15.2 R16.1 49.11,38.1 45.09,38.1 44.25,38.93 Z12.1 C38.1 42.54,40.01 42.23,40.32 35.24,40.32 34.92,40.01 34.92,33.66 34.63,33.36 U$2.6
CHT2+
  Top 0.152: X2.5 80.64,7.62 80.64,12.38 83.19,14.92 83.19,30.48 85.09,32.38 U20.1
CHT2-  (via drill 0.3)
  Top 0.152: X2.7 v76.2,8.89 76.2,34.29 U20.14 | SJ2.2 81.79,9.02 v81.92,8.89
  Bottom 0.152: v81.92,8.89 v76.2,8.89
CHT3
  Top 0.152: R13.2 R14.1 49.11,40.01 45.09,40.01 44.25,40.84 Z11.1 42.55,40.96 42.23,40.64 37.47,40.64 36.83,41.27 C37.1 35.24,42.23 34.61,41.59 34.61,35.56 34.41,35.36 U$2.10
CHT3+
  Top 0.152: X2.9 73.66,6.99 74.93,8.26 74.93,11.43 73.34,13.02 73.34,30.48 74.93,32.07 U21.1
CHT3-
  Top 0.152: 71.12,10.48 X2.11 | 71.12,10.48 71.12,12.38 69.22,14.29 69.22,30.16 67.31,32.07 U21.14 | SJ3.2 71.12,10.48
CHT4
  Top 0.152: R9.2 R11.1 49.11,41.91 45.09,41.91 44.25,42.74 Z10.1 C36.1 42.54,43.5 42.23,43.81 34.61,43.81 34.29,43.5 34.29,36.2 33.95,35.86 U$2.11
CHT4+
  Top 0.152: X2.13 68.58,6.67 66.04,9.21 66.04,34.29 U22.1
CHT4-
  Top 0.152: X2.15 66.04,7.3 65.72,7.62 61.59,7.62 61.28,7.94 61.28,10.48 | 61.28,10.48 61.28,11.75 59.05,13.97 59.05,30.16 57.15,32.07 U22.14 | SJ4.2 61.28,10.48
EGT1
  Top 0.152: R1.2 R2.1 49.11,34.29 45.09,34.29 44.25,35.12 Z6.1 42.55,35.24 | U$2.4 33.08,32.38 35.24,32.38 35.56,32.7 35.56,34.92 35.88,35.24 39.05,35.24 39.69,35.88 41.91,35.88 42.55,35.24 | C15.1 42.54,34.92 42.55,34.92 42.55,35.24
EGT1+
  Top 0.152: X2.2 84.14,3.49 94.3,3.49 95.25,4.45 U14.1
EGT1-
  Top 0.152: X2.4 82.55,4.45 82.55,6.35 83.19,6.99 86.68,6.99 87.63,7.94 87.63,10.48 | 87.63,10.48 U14.14 | SJ5.2 87.63,10.48
EGT2
  Top 0.152: R3.2 R4.1 49.11,32.38 45.09,32.38 44.25,33.22 Z7.1 43.81,33.34 43.5,33.02 41.91,33.02 41.59,33.34 41.59,35.24 41.27,35.56 40.01,35.56 39.37,34.92 37.47,34.92 36.83,34.29 C16.1 36.83,32.07 36.62,31.86 U$2.3
EGT2+
  Top 0.152: X2.6 80.01,4.45 80.01,6.35 81.28,7.62 83.82,7.62 85.09,8.89 U16.1
EGT2-
  Top 0.152: X2.8 77.47,4.45 77.47,10.48 | 77.47,10.48 U16.14 | SJ6.2 77.47,10.48
EGT3
  Top 0.152: R5.2 R6.1 49.11,30.48 45.09,30.48 44.25,31.31 Z8.1 C17.1 42.54,30.8 41.91,30.16 40.01,30.16 38.81,31.36 U$2.2
EGT3+
  Top 0.152: X2.10 74.93,4.45 74.93,6.67 75.25,6.99 75.25,12.38 74.93,12.7 U17.1
EGT3-
  Top 0.152: X2.12 69.85,4.45 69.85,6.35 67.31,8.89 67.31,10.48 | 67.31,10.48 U17.14 | SJ7.2 67.31,10.48
EGT4
  Top 0.152: R7.2 R8.1 49.11,28.57 45.09,28.57 44.25,29.41 Z9.1 C34.1 38.73,30.48 38.36,30.86 U$2.1
EGT4+
  Top 0.152: X2.14 67.31,4.45 67.31,6.67 64.77,9.21 U18.1
EGT4-
  Top 0.152: X2.16 64.77,4.45 64.77,6.99 64.45,7.3 58.74,7.3 57.15,8.89 57.15,10.16 | 57.15,10.16 U18.14 | SJ8.2 57.34,10.35 57.15,10.16
FUEL_FLOW  (via drill 0.3)
  Top 0.152: X2.25 53.34,10.8 C12.2 52.38,11.43 v51.44,12.38 | v20.95,12.38 U12.1
  Bottom 0.152: v51.44,12.38 v20.95,12.38
FUEL_PRESSURE
  Top 0.152: X2.26 52.07,4.45 52.07,8.26 50.16,10.16 R35.1
FUELP3V3  (via drill 0.3)
  Top 0.152: R35.2 C35.2 49.21,15.56 49.05,15.72 49.05,18.73 49.11,18.73 R37.2 49.21,20.74 v49.21,25.08 | U$2.30 24.55,38.63 27.62,35.56 v27.62,32.7
  Bottom 0.152: v27.62,32.7 27.62,29.21 28.57,28.26 37.15,28.26 40.32,25.08 v49.21,25.08
GND  (via drill 0.3)
  Top 0.152: C19.1 v40.64,16.19 | C20.1 v42.86,16.19 | C22.1 v45.09,16.19
  Top 0.406: U6.6 10.48,37.47 12.7,37.47 v13.97,36.2
  Bottom 0.152: v40.64,16.19 v42.86,16.19 v45.09,16.19
  Bottom 0.406: J3.P$4 v13.98,36.2 v13.97,36.2
  Bottom 1.27: X2.23 X2.21 X2.17
  pour Top: 3.81,62.23 3.81,2.54 99.06,2.54 99.06,68.9 86.04,68.9 86.04,62.23
ISENSE  (via drill 0.3)
  Top 0.152: X2.22 59.69,4.45 59.69,6.67 59.37,6.99 57.78,6.99 v56.83,7.94 | v54.93,7.94 54.93,11.21 R56.1
  Bottom 0.152: v56.83,7.94 v54.93,7.94
ISENSE3V3  (via drill 0.3)
  Top 0.152: R56.2 52.7,15.14 C21.2 51.75,15.56 51.59,15.72 51.59,18.57 52.7,19.68 R57.1 51.75,20.74 51.75,22.34 Z4.1 51.44,24.57 v51.44,27.3 | U$2.14 31.32,37.36 29.53,35.56 29.53,32.7 v30.8,31.43
  Bottom 0.152: v30.8,31.43 35.88,31.43 40.01,27.3 v51.44,27.3
LEFT_FUEL
  Top 0.152: X2.29 48.26,8.26 47.62,8.89 43.5,8.89 42.86,9.53 R23.2 42.6,11.53 41.75,12.38 41.75,20.38 R54.1
LEFT_RX  (via drill 0.3)
  Top 0.152: v18.73,13.97 18.73,17.78 19.68,18.73 19.68,26.99 20.32,27.62 20.32,33.97 20.7,34.36 U$2.41 | v25.4,13.97 U4.12
  Bottom 0.152: v18.73,13.97 v25.4,13.97
LEFT_RXD  (via drill 0.3)
  Top 0.152: v24.13,11.11 U4.13
  Bottom 0.152: X2.32 44.45,4.45 44.45,11.43 44.13,11.75 24.77,11.75 v24.13,11.11
LEFT_TACH  (via drill 0.3)
  Top 0.152: X2.33 43.18,6.03 38.42,10.79 v38.42,14.61 C23.2 | v26.04,18.1 U12.5
  Bottom 0.152: v38.42,14.61 38.42,14.92 37.78,15.56 26.35,15.56 26.04,15.88 v26.04,18.1
LEFT_TX  (via drill 0.3)
  Top 0.152: v17.46,12.7 17.46,18.1 19.05,19.68 v19.05,32.7 | v26.67,13.02 U4.11 | U$2.42 22.75,33.86 v23.18,34.29
  Bottom 0.152: v17.46,12.7 20.32,12.7 20.64,13.02 v26.67,13.02 | v23.18,34.29 20.64,34.29 v19.05,32.7
LEFT_TXD  (via drill 0.3)
  Top 0.152: v22.86,11.43 U4.14
  Bottom 0.152: X2.31 45.72,11.75 45.4,12.06 23.5,12.06 v22.86,11.43
LEFTF3V3  (via drill 0.3)
  Top 0.152: C20.2 R54.2 42.86,19.84 43.66,20.64 43.66,22.5 Z3.1 41.91,24.25 v41.91,27.94 | U$2.13 31.46,36.86 29.84,35.24 29.84,33.02 30.8,32.07 v31.43,32.07
  Bottom 0.152: v31.43,32.07 35.88,32.07 40.01,27.94 v41.91,27.94
MAP3V3  (via drill 0.3)
  Top 0.152: R33.2 R34.2 v18.1,43.18 | v25.4,41.91 26.05,41.26 U$2.27
  Bottom 0.152: v25.4,41.91 20.64,41.91 19.37,43.18 v18.1,43.18
N$1
  Top 0.152: R18.2 19.79,44.55 C56.1 19.69,43.28 R31.2
N$2
  Top 0.152: U7.7 46.35,51.76 46.77,51.33 R24.1
N$5
  Top 0.152: C33.1 20.32,5.72 U4.1
N$6
  Top 0.152: C33.2 22.86,5.72 U4.3
N$7
  Top 0.152: U4.4 24.13,7.3 24.77,6.67 C41.2
N$9
  Top 0.152: U4.5 25.4,7.3 26.67,6.04 C41.1
N$10
  Top 0.152: U4.2 21.59,4.13 C42.2
N$11
  Top 0.152: U4.6 26.67,7.3 27.62,6.35 27.62,4.13 C43.2
N$12
  Top 0.635: U6.2 8.78,20.68 L2.1 8.26,20.95 D2.C
N$16  (via drill 0.3)
  Top 0.152: U$2.31 24.05,43.74 v24.77,44.45 | v35.88,44.45 35.88,46.2 U11.3
  Bottom 0.152: v24.77,44.45 v35.88,44.45
N$35  (via drill 0.3)
  Top 0.152: v33.66,57.47 33.66,40.64 33.37,40.36 U$2.17
  Bottom 0.152: v33.66,57.47 39.69,57.47 J1.1
N$36  (via drill 0.3)
  Top 0.152: U18.9 U18.8 | v54.61,29.21 54.29,29.53 R7.1
  Bottom 0.152: U18.8 v54.61,29.21
N$37
  Top 0.152: U7.5 44.37,49.45 43.78,48.87 C6.-
N$38
  Top 0.152: U7.6 45.4,51.11 45.4,51.12 45.72,50.8 45.72,49.53 46.38,48.87 C6.+
N$55
  Top 0.152: U1.1 15.62,46.42 C11.1 15.56,44.87 R33.1
N$63  (via drill 0.3)
  Top 0.152: U14.9 U14.8 | v54.61,34.92 54.29,35.24 R1.1
  Bottom 0.152: U14.8 85.72,31.11 56.2,31.11 55.24,32.07 55.24,34.29 v54.61,34.92
N$64  (via drill 0.3)
  Top 0.152: U16.9 U16.8 | v54.61,33.02 54.29,33.34 R3.1
  Bottom 0.152: U16.8 75.88,30.8 55.88,30.8 54.61,32.07 v54.61,33.02
N$65  (via drill 0.3)
  Top 0.152: U17.9 U17.8 | v54.61,31.11 54.29,31.43 R5.1
  Bottom 0.152: U17.8 66.04,30.48 55.24,30.48 v54.61,31.11
N$66  (via drill 0.3)
  Top 0.152: U19.9 U19.8 | R17.1 55.56,37.15 55.88,37.47 55.88,51.12 56.2,51.44 v56.2,53.34
  Bottom 0.152: v56.2,53.34 56.83,52.7 85.72,52.7 U19.8
N$73  (via drill 0.3)
  Top 0.152: U22.8 U22.9 | v54.61,48.26 54.61,43.18 54.29,42.86 R9.1
  Bottom 0.152: U22.9 v54.61,48.26
N$74  (via drill 0.3)
  Top 0.152: U21.9 U21.8 | R13.1 54.93,40.96 55.24,41.27 v55.24,52.07
  Bottom 0.152: v55.24,52.07 66.04,52.07 U21.8
N$75  (via drill 0.3)
  Top 0.152: U20.8 U20.9 | R15.1 55.24,39.05 55.56,39.37 55.56,51.44 55.88,51.75 55.88,52.7 v55.24,53.34
  Bottom 0.152: v55.24,53.34 56.2,52.39 75.88,52.39 U20.8
OAT
  Top 0.152: X2.38 36.83,4.45 36.83,7.3 32.7,11.43 32.7,12.7 32.17,13.23 R28.1 C24.1 30.48,15.56 30.16,15.88 30.16,18.41 30.48,18.73 R26.1
OAT_3V3
  Top 0.152: 31.43,21.59 Z14.1 30.8,23.93 30.8,26.35 31.05,26.61 U$2.64 | 31.43,21.59 31.54,21.49 R27.2 | R26.2 30.58,21.59 31.43,21.59
OIL_PRESSURE
  Top 0.152: X2.27 50.8,8.57 49.85,9.53 47.94,9.53 47.31,10.16 R36.1
OIL_TEMPERATURE
  Top 0.152: X2.28 49.53,4.45 49.53,8.89 49.21,9.21 46.04,9.21 45.09,10.16 45.09,11.27 | 45.09,11.27 R25.2 | 45.09,11.27 43.97,12.38 43.97,20.38 R10.1
OILP3V3  (via drill 0.3)
  Top 0.152: R36.2 C14.2 46.51,16.35 46.2,16.67 46.2,18.73 47.25,19.79 R38.2 46.35,20.74 v46.35,26.04 | U$2.29 25.05,38.76 28.26,35.56 28.26,33.02 28.57,32.7 28.57,30.8 v29.21,30.16
  Bottom 0.152: v29.21,30.16 30.8,28.57 37.47,28.57 40.64,25.4 45.72,25.4 v46.35,26.04
OILT3V3  (via drill 0.3)
  Top 0.152: C22.2 R10.2 45.19,19.79 45.88,20.48 45.88,22.54 45.12,23.3 Z5.1 44.13,24.25 v44.13,26.35 | U$2.22 28.55,33.67 28.89,33.36 28.89,31.43 v30.16,30.16
  Bottom 0.152: v30.16,30.16 31.43,28.89 37.78,28.89 39.69,26.99 43.5,26.99 v44.13,26.35
PGC  (via drill 0.3)
  Top 0.152: v31.43,38.1 31.68,37.86 U$2.15
  Bottom 0.152: 15.54,38.73 J3.P$2 16.86,38.7 18.41,37.15 28.57,37.15 29.21,37.78 31.11,37.78 v31.43,38.1
PGD  (via drill 0.3)
  Top 0.152: v29.84,37.15 30.8,38.1 30.8,38.42 31.11,38.73 32.07,38.73 32.45,38.36 U$2.16
  Bottom 0.152: J3.P$3 15.52,37.47 17.46,37.47 18.41,36.51 29.21,36.51 v29.84,37.15
RIGHT_FUEL
  Top 0.152: X2.30 46.99,4.45 46.99,7.94 46.35,8.57 42.86,8.57 40.64,10.79 R21.2 39.53,12.64 39.53,20.48 40.32,21.27 40.64,21.27 R12.1
RIGHT_RX  (via drill 0.3)
  Top 0.152: v19.37,14.61 19.37,17.46 20,18.1 20,26.35 20.64,26.99 v20.64,29.53 | v29.21,13.65 U4.9 | U$2.52 25.05,30.19 v24.77,30.48
  Bottom 0.152: v19.37,14.61 28.26,14.61 v29.21,13.65 | v24.77,30.48 21.59,30.48 v20.64,29.53
RIGHT_RXD  (via drill 0.3)
  Top 0.152: v30.48,8.89 29.39,8.89 U4.8
  Bottom 0.152: X2.35 40.64,8.26 40.01,8.89 v30.48,8.89
RIGHT_TACH  (via drill 0.3)
  Top 0.152: X2.36 39.37,4.45 39.37,7.62 36.2,10.79 v36.2,14.61 C13.2 | v23.5,17.46 U12.3
  Bottom 0.152: v36.2,14.61 29.53,14.61 29.21,14.92 26.04,14.92 v23.5,17.46
RIGHT_TX  (via drill 0.3)
  Top 0.152: v18.1,13.34 18.1,18.1 19.37,19.37 19.37,27.3 19.68,27.62 v19.68,30.48 | v27.94,13.65 U4.10 | U$2.53 25.55,30.01 v25.72,30.48
  Bottom 0.152: v18.1,13.34 26.04,13.34 26.35,13.65 v27.94,13.65 | v25.72,30.48 24.77,31.43 22.86,31.43 22.23,30.8 21.27,30.8 20.95,30.48 v19.68,30.48
RIGHT_TXD  (via drill 0.3)
  Top 0.152: v27.94,10.79 U4.7
  Bottom 0.152: X2.34 41.91,4.45 41.91,10.48 41.59,10.79 v27.94,10.79
RIGHTF3V3  (via drill 0.3)
  Top 0.152: C19.2 R12.2 40.64,19.84 41.43,20.64 41.43,22.5 Z2.1 39.69,24.25 39.69,26.35 40.32,26.99 v40.32,28.57 | U$2.12 31.59,36.36 30.16,34.92 30.16,33.66 v30.8,33.02
  Bottom 0.152: v30.8,33.02 35.88,33.02 v40.32,28.57
SCL  (via drill 0.3)
  Top 0.152: U3.6 8.26,9.53 10.64,7.14 12.86,7.14 13.65,7.94 R30.1 15.34,8.04 15.56,8.26 15.56,25.08 15.88,25.4 v15.88,31.11 | v23.18,32.7 23.02,32.86 U$2.44
  Bottom 0.152: v15.88,31.11 21.59,31.11 v23.18,32.7
SDA  (via drill 0.3)
  Top 0.152: U3.5 9.53,9.53 11.01,8.04 R29.1 11.85,8.04 12.7,8.89 14.92,8.89 15.24,9.21 v15.24,32.07 | v23.81,33.34 23.48,33.36 U$2.43
  Bottom 0.152: v15.24,32.07 20.32,32.07 21.59,33.34 v23.81,33.34
VSENSE
  Top 0.152: X2.37 38.1,7.94 34.51,11.53 R20.1
VSENSE3V3  (via drill 0.3)
  Top 0.152: R20.2 C18.2 33.02,15.56 32.7,15.88 32.7,18.52 R53.1 33.87,19.79 33.02,20.64 33.02,22.34 Z1.1 32.7,24.57 v32.7,29.53 | U$2.21 29.05,34.13 29.21,33.81 29.21,32.07 30.48,30.8 v31.43,30.8
  Bottom 0.152: v31.43,30.8 v32.7,29.53

### Text on the board
tNames: (C) 2016, 2017 Kotuku Aerospace Ltd / EDU ver 4.4